# Altium schematic sheet 0225_GPU_GPIO 1 OF 2.SchDoc
size 848 x 558 mm
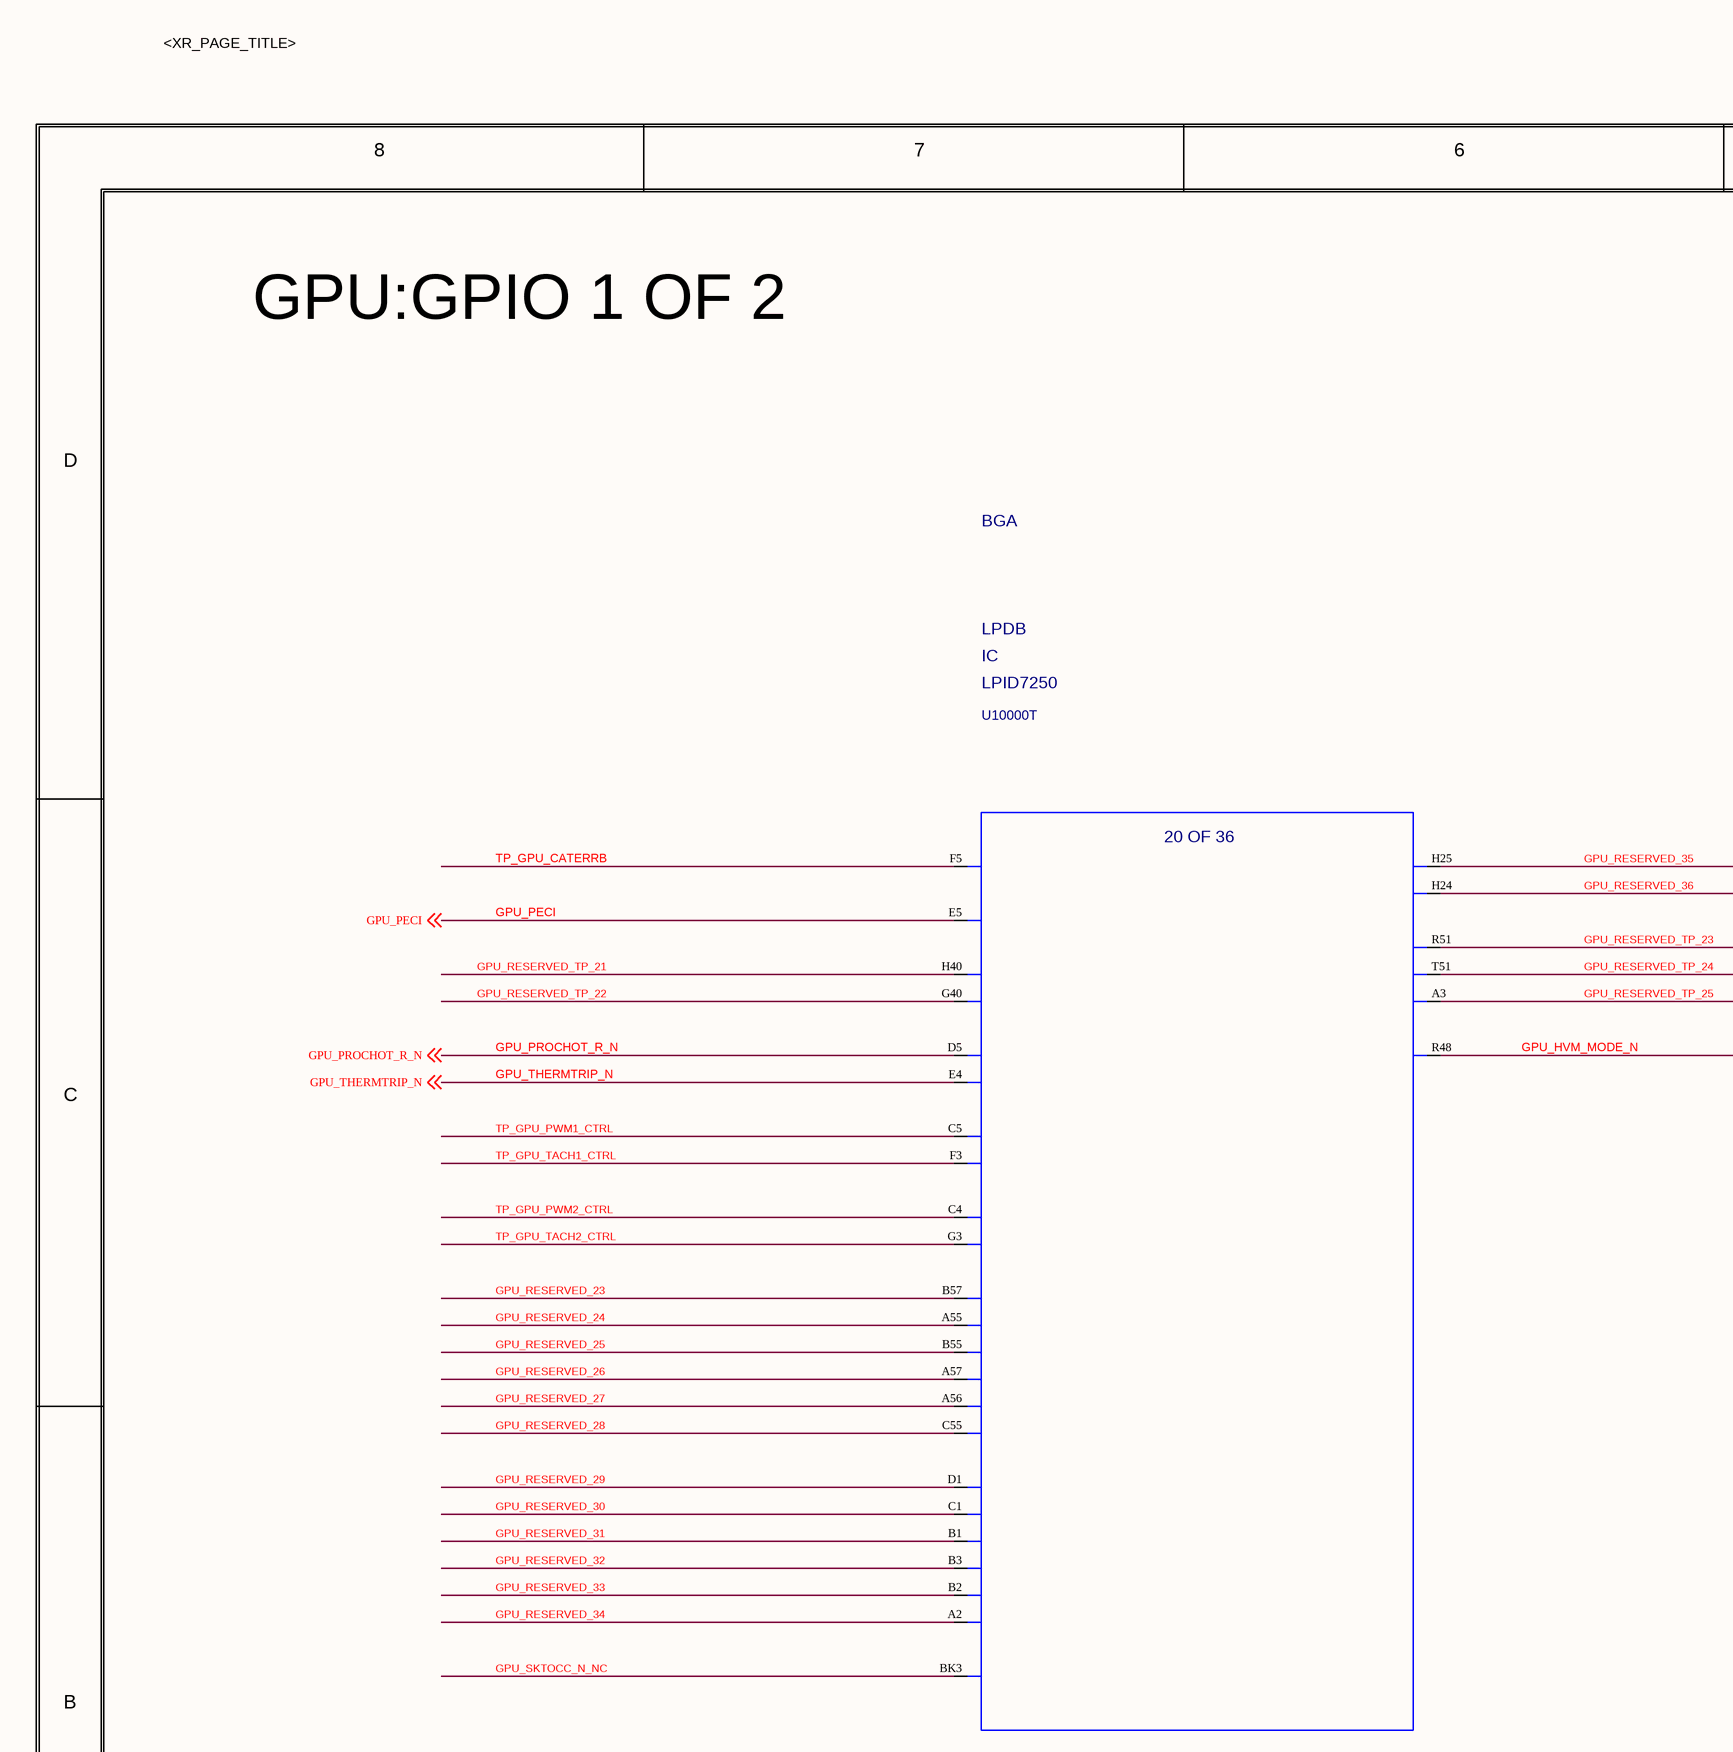
[diagram p0: 0225_GPU_GPIO 1 OF 2.SchDoc, top left]
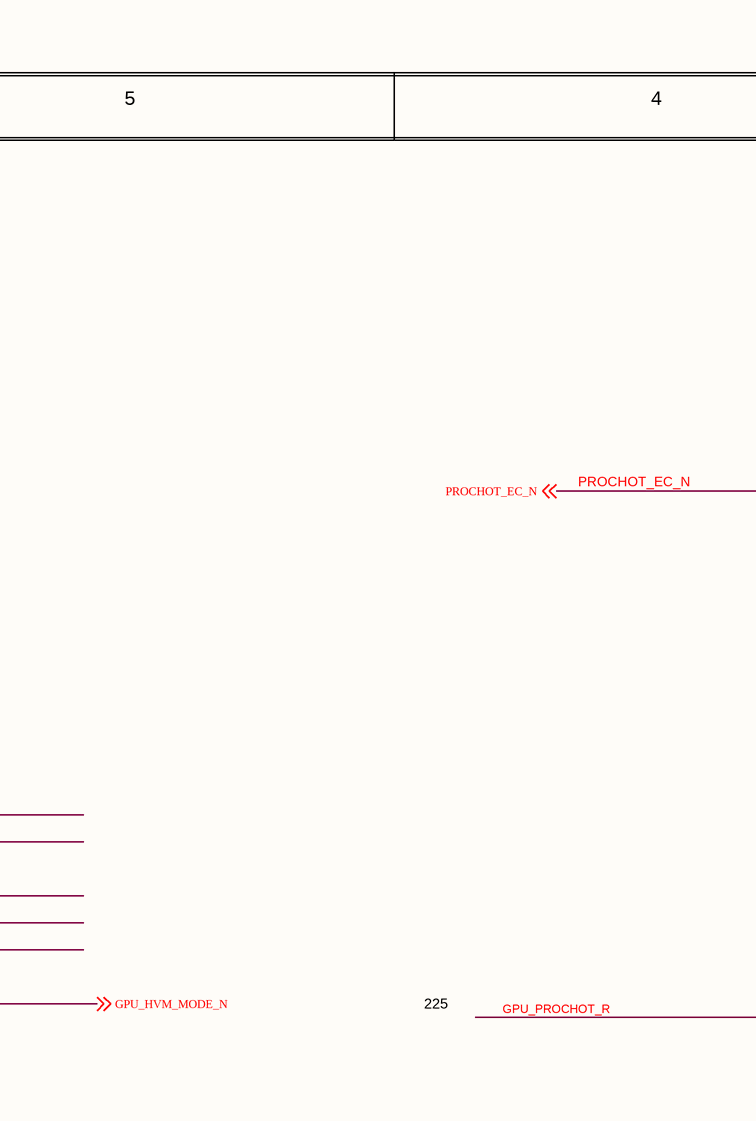
[diagram p1: 0225_GPU_GPIO 1 OF 2.SchDoc, top middle]
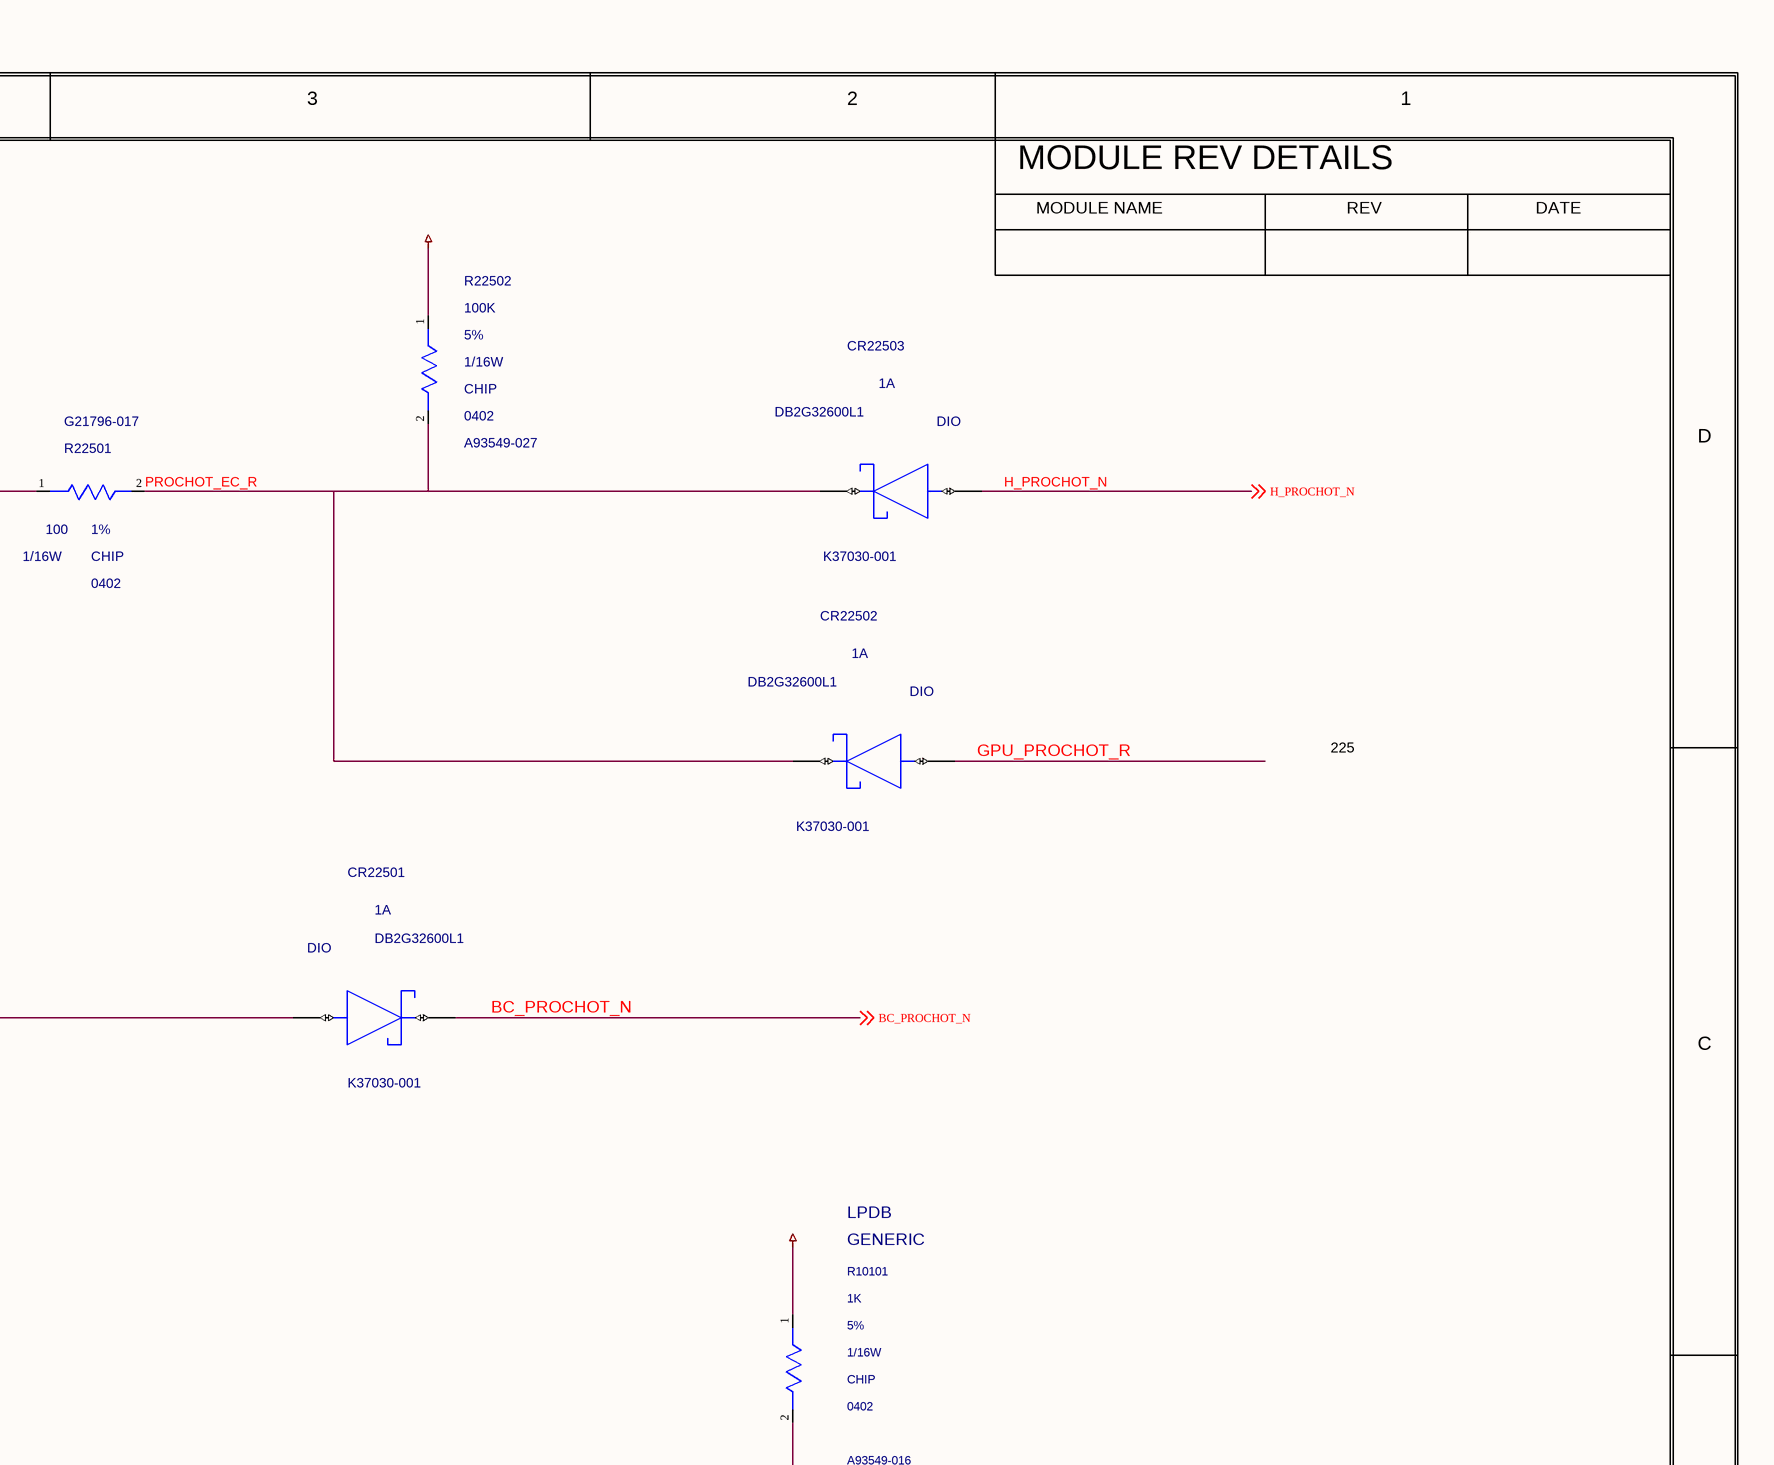
[diagram p2: 0225_GPU_GPIO 1 OF 2.SchDoc, top right]
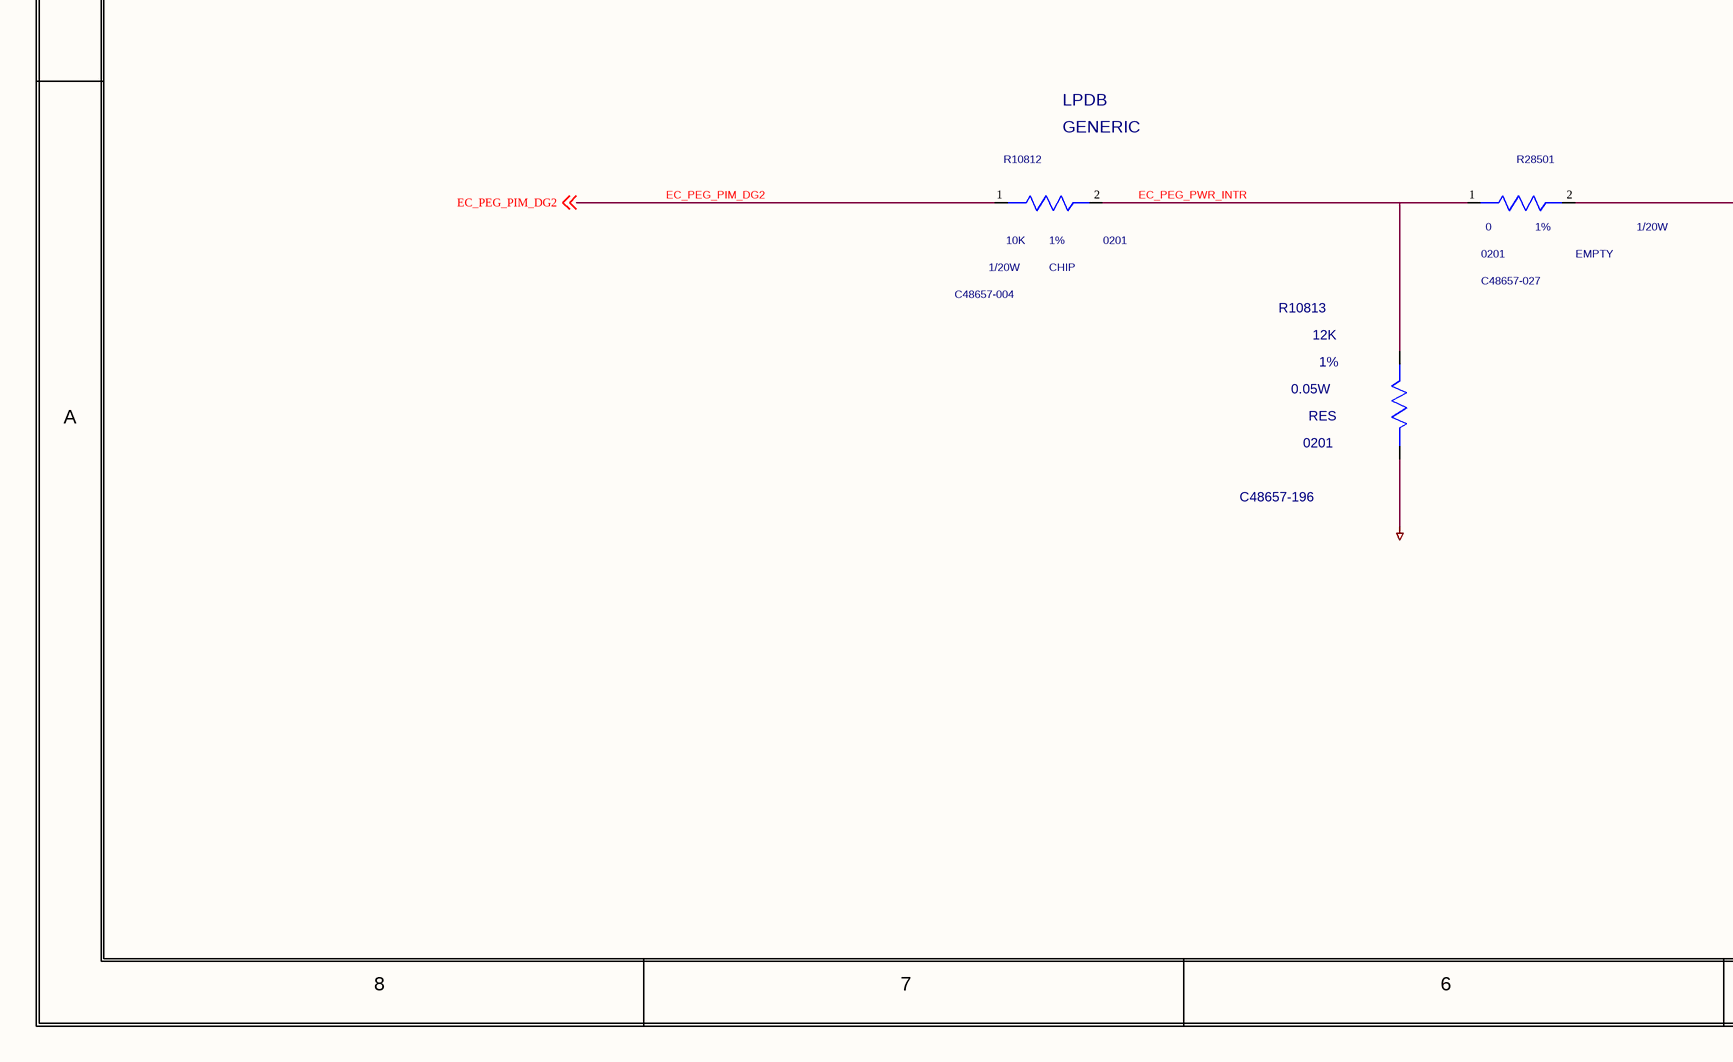
[diagram p3: 0225_GPU_GPIO 1 OF 2.SchDoc, bottom left]
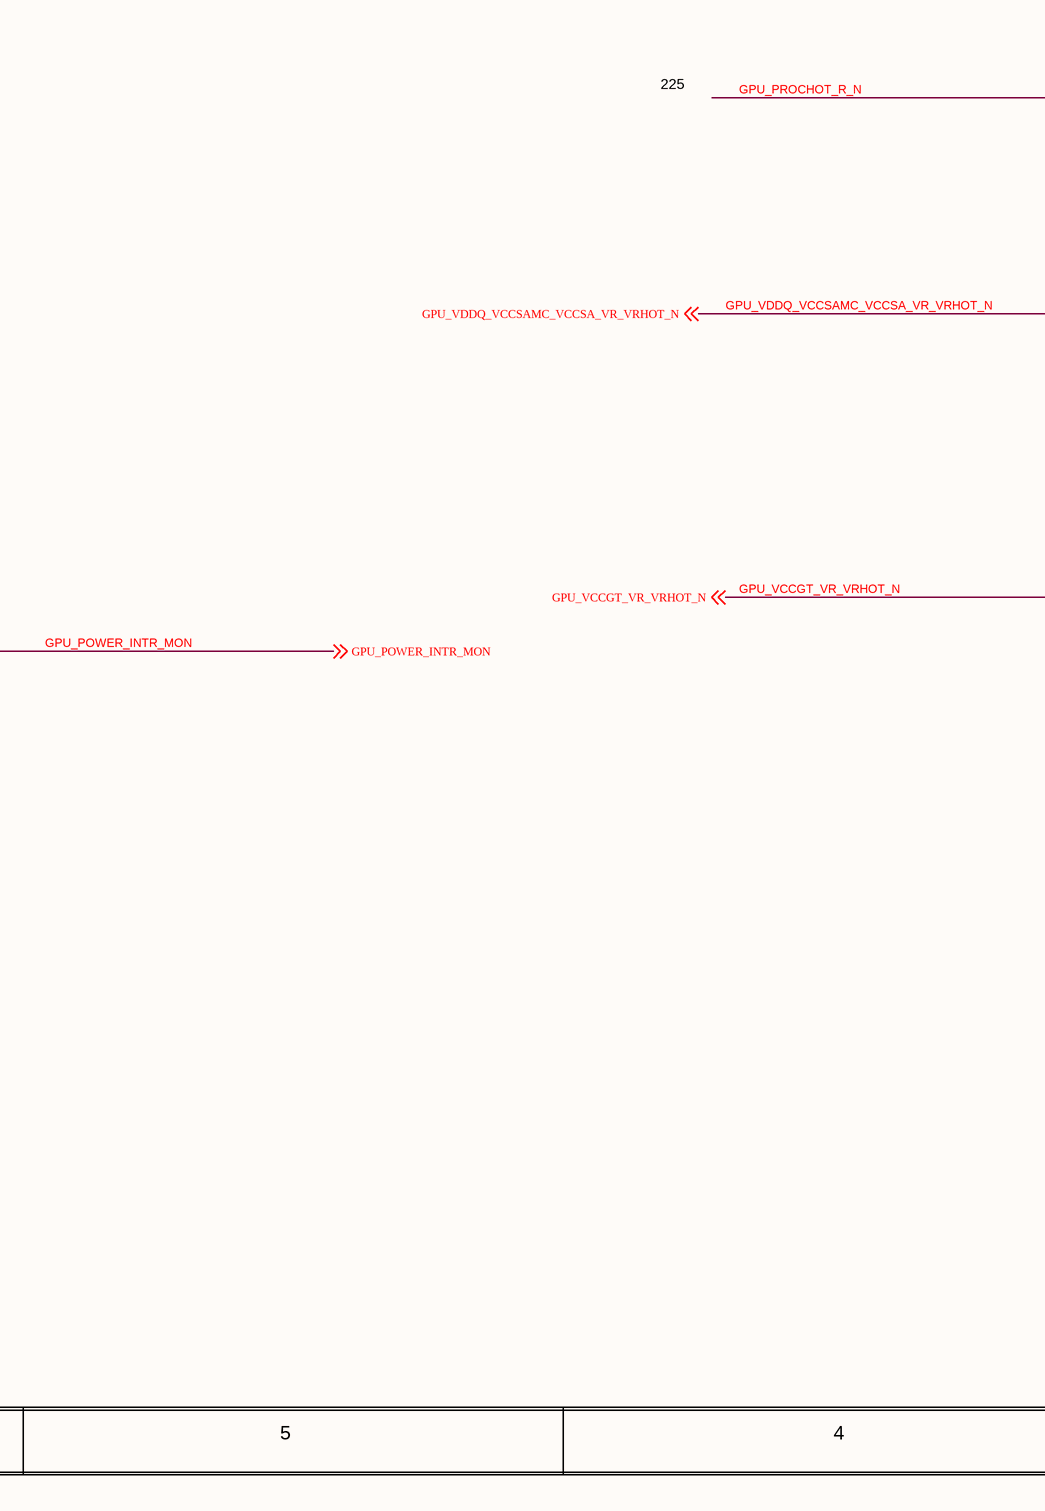
[diagram p4: 0225_GPU_GPIO 1 OF 2.SchDoc, bottom middle]
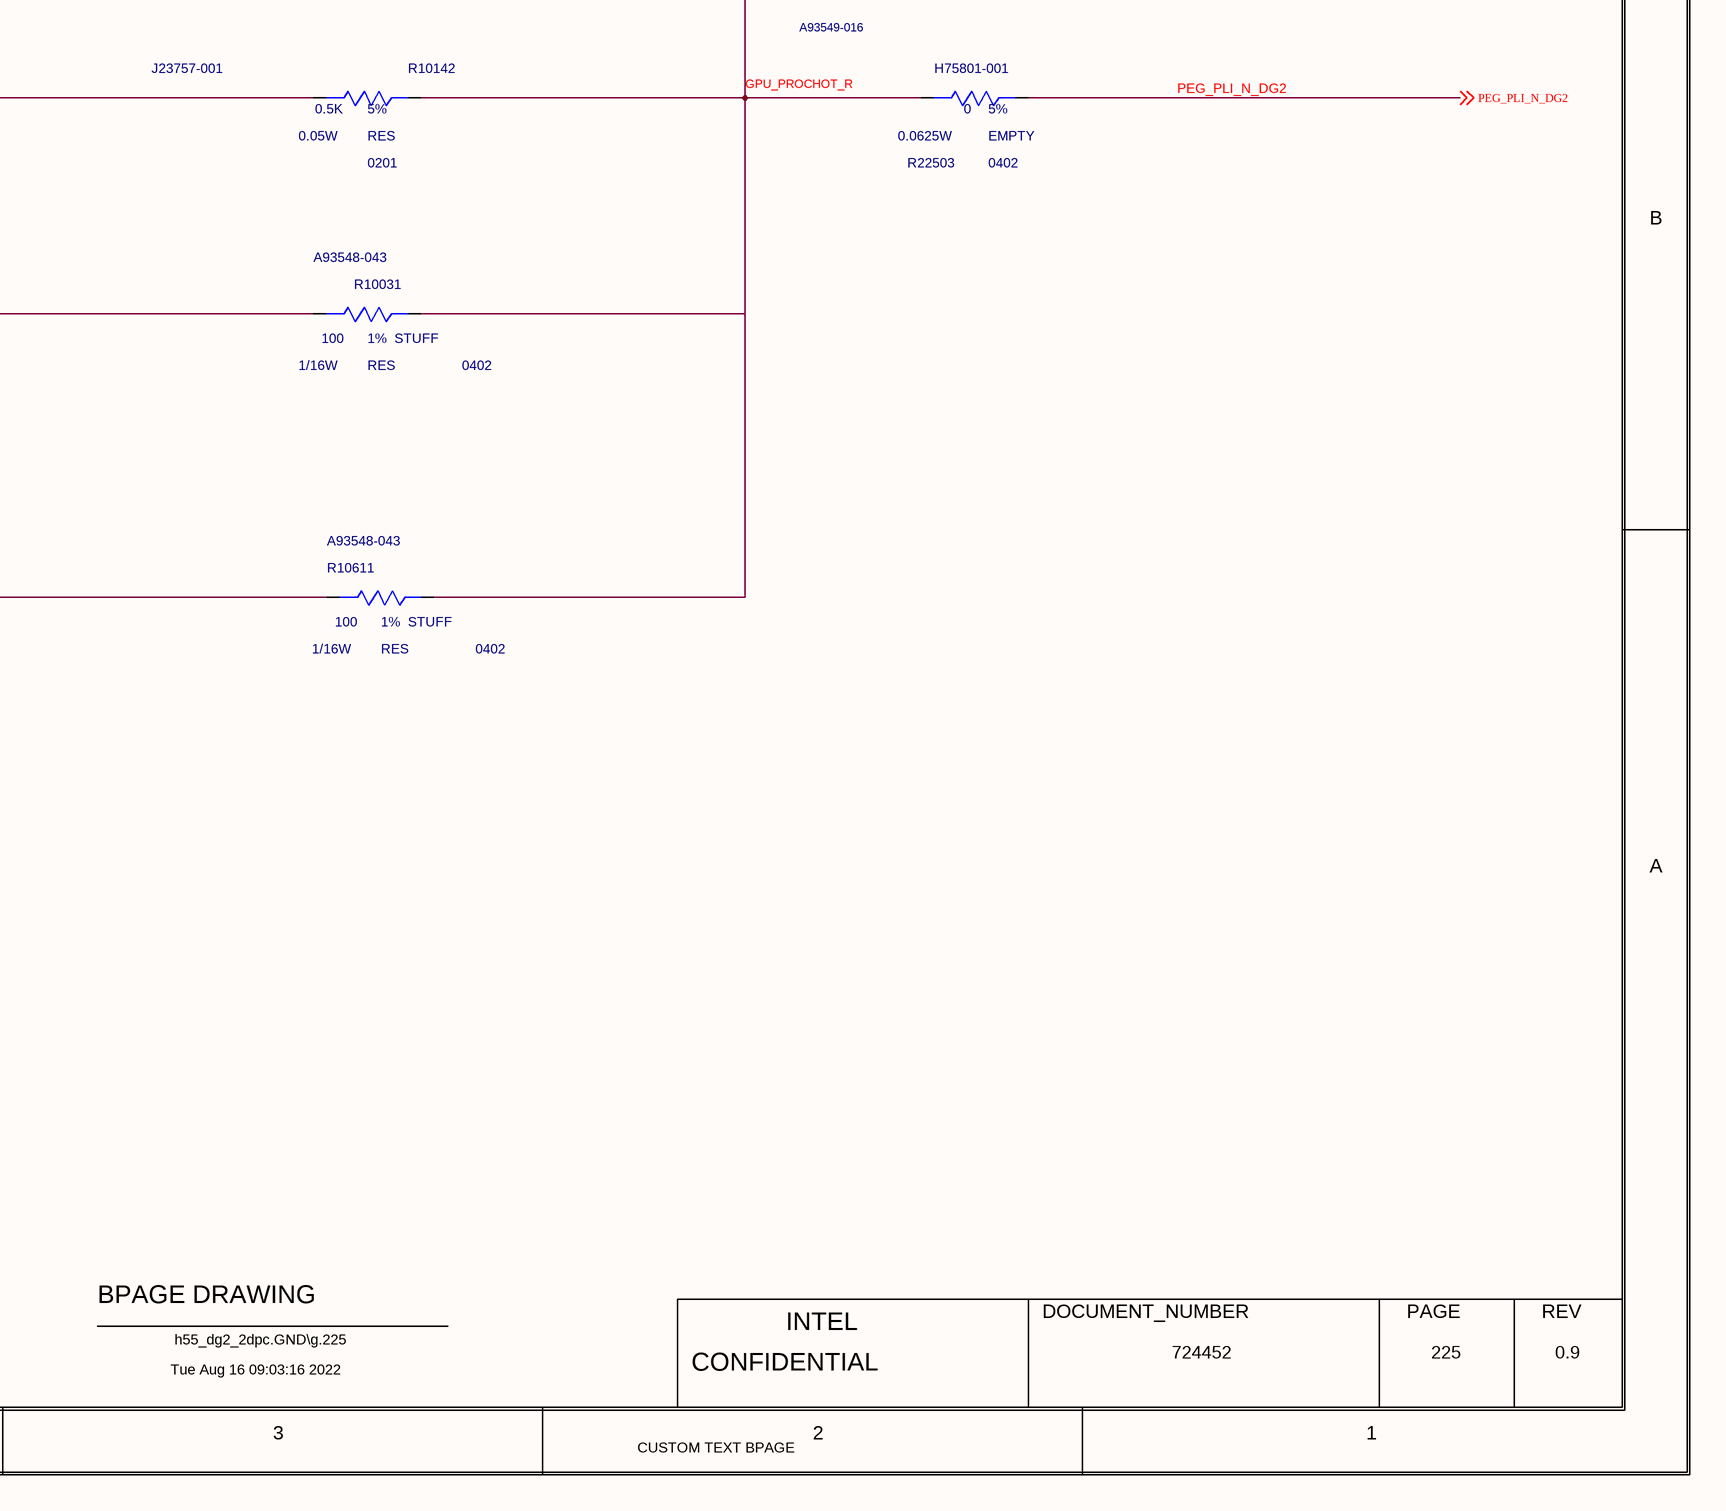
[diagram p5: 0225_GPU_GPIO 1 OF 2.SchDoc, bottom right]

## Parts
CR22501  DB2G32600L1  CURRENT: 1A  MATERIAL: DIO  PART_NUMBER: K37030-001  [TK0_SCR0402_1050X650_MA]
CR22502  DB2G32600L1  CURRENT: 1A  MATERIAL: DIO  PART_NUMBER: K37030-001  [TK0_SCR0402_1050X650_MA]
CR22503  DB2G32600L1  CURRENT: 1A  MATERIAL: DIO  PART_NUMBER: K37030-001  [TK0_SCR0402_1050X650_MA]
R10031  100  BOM_USE: STUFF  MATERIAL: RES  PACK_TYPE: 0402  PART_NUMBER: A93548-043  TOLERANCE: 1%  WATTAGE: 1/16W  [TK2_SM0402_1050X550_MA]
R10101  1K  MATERIAL: CHIP  PACK_TYPE: 0402  PART_NUMBER: A93549-016  TOLERANCE: 5%  WATTAGE: 1/16W  IP: GENERIC  FP_TECH: LPDB  [SMR0402IA]
R10142  0.5K  MATERIAL: RES  PACK_TYPE: 0201  PART_NUMBER: J23757-001  TOLERANCE: 5%  WATTAGE: 0.05W  [TK0_SM0201_630X330_ME]
R10611  100  BOM_USE: STUFF  MATERIAL: RES  PACK_TYPE: 0402  PART_NUMBER: A93548-043  TOLERANCE: 1%  WATTAGE: 1/16W  [TK2_SM0402_1050X550_MA]
R10812  10K  MATERIAL: CHIP  PACK_TYPE: 0201  PART_NUMBER: C48657-004  TOLERANCE: 1%  WATTAGE: 1/20W  IP: GENERIC  FP_TECH: LPDB  [SMR0201IA]
R10813  12K  MATERIAL: RES  PACK_TYPE: 0201  PART_NUMBER: C48657-196  TOLERANCE: 1%  WATTAGE: 0.05W  [CTK0_SM0201_630X330_MA]
R22501  100  MATERIAL: CHIP  PACK_TYPE: 0402  PART_NUMBER: G21796-017  TOLERANCE: 1%  WATTAGE: 1/16W  [SMR0402IA]
R22502  100K  MATERIAL: CHIP  PACK_TYPE: 0402  PART_NUMBER: A93549-027  TOLERANCE: 5%  WATTAGE: 1/16W  [SMR0402IA]
R22503  0  MATERIAL: EMPTY  PACK_TYPE: 0402  PART_NUMBER: H75801-001  TOLERANCE: 5%  WATTAGE: 0.0625W  [CTK2_SM0402_1100X550_MA]
R28501  0  MATERIAL: EMPTY  PACK_TYPE: 0201  PART_NUMBER: C48657-027  TOLERANCE: 1%  WATTAGE: 1/20W  [SMR0201IA]
U10000  PART_NUMBER: LPID7250  PACK_TYPE: BGA  MATERIAL: IC  FP_TECH: LPDB  [CLPDB_BGA2660_DG2_SVC_512_LP7250_MA]  (hidden comment: DG2_IP_NB_SKU1_SKU2_SKU3_EXT)  (part T of 36)

## Nets
+V1P8S_GPU: R10101.1(A)
+V3P3A: R22502.1(A)
GND: R10813.2(B)
BC_PROCHOT_N: CR22501.1(CATHODE) ; off-sheet BC_PROCHOT_N
EC_PEG_PIM_DG2: R10812.1(A) ; off-sheet EC_PEG_PIM_DG2
EC_PEG_PWR_INTR: R10812.2(B) R10813.1(A) R28501.1(A)
GPU_HVM_MODE_N: U10000.R48(HVM_MODE#) ; off-sheet GPU_HVM_MODE_N
GPU_PECI: U10000.E5(PECI) ; off-sheet GPU_PECI
GPU_POWER_INTR_MON: R28501.2(B) ; off-sheet GPU_POWER_INTR_MON
GPU_PROCHOT_R: CR22501.2(ANODE) CR22502.2(ANODE) R10031.2(B) R10101.2(B) R10142.2(B) R10611.2(B) R22503.1(A)
GPU_PROCHOT_R_N: R10142.1(A) U10000.D5(PROCHOT#) ; off-sheet GPU_PROCHOT_R_N
GPU_RESERVED_23: U10000.B57(RSVD_23)
GPU_RESERVED_24: U10000.A55(RSVD_24)
GPU_RESERVED_25: U10000.B55(RSVD_25)
GPU_RESERVED_26: U10000.A57(RSVD_26)
GPU_RESERVED_27: U10000.A56(RSVD_27)
GPU_RESERVED_28: U10000.C55(RSVD_28)
GPU_RESERVED_29: U10000.D1(RSVD_29)
GPU_RESERVED_30: U10000.C1(RSVD_30)
GPU_RESERVED_31: U10000.B1(RSVD_31)
GPU_RESERVED_32: U10000.B3(RSVD_32)
GPU_RESERVED_33: U10000.B2(RSVD_33)
GPU_RESERVED_34: U10000.A2(RSVD_34)
GPU_RESERVED_35: U10000.H25(RSVD_35)
GPU_RESERVED_36: U10000.H24(RSVD_36)
GPU_RESERVED_TP_21: U10000.H40(RSVD_TP_21)
GPU_RESERVED_TP_22: U10000.G40(RSVD_TP_22)
GPU_RESERVED_TP_23: U10000.R51(RSVD_TP_23)
GPU_RESERVED_TP_24: U10000.T51(RSVD_TP_24)
GPU_RESERVED_TP_25: U10000.A3(RSVD_TP_25)
GPU_SKTOCC_N_NC: U10000.BK3(SKTOCC#)
GPU_THERMTRIP_N: U10000.E4(THRMTRIP#) ; off-sheet GPU_THERMTRIP_N
GPU_VCCGT_VR_VRHOT_N: R10611.1(A) ; off-sheet GPU_VCCGT_VR_VRHOT_N
GPU_VDDQ_VCCSAMC_VCCSA_VR_VRHOT_N: R10031.1(A) ; off-sheet GPU_VDDQ_VCCSAMC_VCCSA_VR_VRHOT_N
H_PROCHOT_N: CR22503.2(ANODE) ; off-sheet H_PROCHOT_N
PEG_PLI_N_DG2: R22503.2(B) ; off-sheet PEG_PLI_N_DG2
PROCHOT_EC_N: R22501.1(A) ; off-sheet PROCHOT_EC_N
PROCHOT_EC_R: CR22502.1(CATHODE) CR22503.1(CATHODE) R22501.2(B) R22502.2(B)
TP_GPU_CATERRB: U10000.F5(CATERR#)
TP_GPU_PWM1_CTRL: U10000.C5(PWM1_CTRL)
TP_GPU_PWM2_CTRL: U10000.C4(PWM2_CTRL)
TP_GPU_TACH1_CTRL: U10000.F3(TACH1_CTRL)
TP_GPU_TACH2_CTRL: U10000.G3(TACH2_CTRL)

## Notes on the sheet
- <XR_PAGE_TITLE>
- 8
- 7
- 6
- 5
- 4
- 3
- 2
- 1
- MODULE REV DETAILS
- MODULE NAME
- REV
- DATE
- GPU:GPIO 1 OF 2
- D
- 225
- C
- B
- A
- BPAGE DRAWING
- INTEL
- DOCUMENT_NUMBER
- PAGE
- Tue Aug 16 09:03:16 2022
- h55_dg2_2dpc.GND\g.225
- CONFIDENTIAL
- 724452
- 0.9
- CUSTOM TEXT BPAGE
- (in symbol DG2_IP_NB_SKU1_SKU2_SKU3_EXT, part T) 20 OF 36

## Library data of the parts
CR22501 = DIODE_SCHOTTKY_2: CDS_PHYS_PART_NAME: DIODE_SCHOTTKY_2_SM-K37030-001,DIO,DB2G32600L1,1A,TK0,GENERIC; BOM_USE: STUFF; CDS_LMAN_SYM_OUTLINE: -50,100,50,-100; FP_TECH: TK0; IP: GENERIC; PACK_TYPE: SM; ROOM: NONE; OriginalSymbolOrigin: (-75,50); XY: (5375,4775); VER: 1; ROT: 0; PHYS_PAGE: 225; LOCATION: CR22501; DRAWING: @RVP1_ADL_SB_ADP_S_DDR5_SODIMM_2DPC_LIB.H55_DG2_2DPC(SCH_1):PAGE396; CDS_LIB: local; VARIANT: ?; PCB Footprint: TK0_SCR0402_1050X650_MA; CHIPS_PART_NAME: DIODE_SCHOTTKY_2; CDS_PART_NAME: DIODE_SCHOTTKY_2_SM-K37030-001,DIO,DB2G32600L1,1A,TK0,GENERIC; CDS_LOCATION: CR22501
CR22502 = DIODE_SCHOTTKY_2: CDS_PHYS_PART_NAME: DIODE_SCHOTTKY_2_SM-K37030-001,DIO,DB2G32600L1,1A,TK0,GENERIC; BOM_USE: STUFF; CDS_LMAN_SYM_OUTLINE: -50,100,50,-100; FP_TECH: TK0; IP: GENERIC; PACK_TYPE: SM; ROOM: NONE; OriginalSymbolOrigin: (-75,50); XY: (6300,5250); VER: 1; ROT: 2; PHYS_PAGE: 225; LOCATION: CR22502; DRAWING: @RVP1_ADL_SB_ADP_S_DDR5_SODIMM_2DPC_LIB.H55_DG2_2DPC(SCH_1):PAGE396; CDS_LIB: local; VARIANT: ?; PCB Footprint: TK0_SCR0402_1050X650_MA; CHIPS_PART_NAME: DIODE_SCHOTTKY_2; CDS_PART_NAME: DIODE_SCHOTTKY_2_SM-K37030-001,DIO,DB2G32600L1,1A,TK0,GENERIC; CDS_LOCATION: CR22502
CR22503 = DIODE_SCHOTTKY_2: CDS_PHYS_PART_NAME: DIODE_SCHOTTKY_2_SM-K37030-001,DIO,DB2G32600L1,1A,TK0,GENERIC; BOM_USE: STUFF; CDS_LMAN_SYM_OUTLINE: -50,100,50,-100; FP_TECH: TK0; IP: GENERIC; PACK_TYPE: SM; ROOM: NONE; OriginalSymbolOrigin: (-75,50); XY: (6350,5750); VER: 1; ROT: 2; PHYS_PAGE: 225; LOCATION: CR22503; DRAWING: @RVP1_ADL_SB_ADP_S_DDR5_SODIMM_2DPC_LIB.H55_DG2_2DPC(SCH_1):PAGE396; CDS_LIB: local; VARIANT: ?; PCB Footprint: TK0_SCR0402_1050X650_MA; CHIPS_PART_NAME: DIODE_SCHOTTKY_2; CDS_PART_NAME: DIODE_SCHOTTKY_2_SM-K37030-001,DIO,DB2G32600L1,1A,TK0,GENERIC; CDS_LOCATION: CR22503
R10031 = RES_2#1: CHIPS_PART_NAME: RES_2; CDS_PHYS_PART_NAME: RES_2_0402-A93548-043,RES,100,1%,1/16W,TK2,GENERIC; CDS_LMAN_SYM_OUTLINE: -50,50,50,-50; FP_TECH: TK2; IP: GENERIC; ROOM: NONE; OriginalSymbolOrigin: (-75,25); XY: (5450,3425); VER: 1; ROT: 0; PHYS_PAGE: 225; LOCATION: R10031; DRAWING: @RVP1_ADL_SB_ADP_S_DDR5_SODIMM_2DPC_LIB.H55_DG2_2DPC(SCH_1):PAGE396; CDS_LIB: discrete_2; VARIANT: ?; PCB Footprint: TK2_SM0402_1050X550_MA; CDS_PART_NAME: RES_2_0402-A93548-043,RES,100,1%,1/16W,TK2,GENERIC; CDS_LOCATION: R10031
R10101 = RES: CDS_PHYS_PART_NAME: RES_0402-A93549-016,CHIP,1K,5%,1/16W,LPDB,GENERIC; OriginalSymbolOrigin: (-25,75); XY: (6150,4125); VER: 2; ROT: 0; PHYS_PAGE: 225; LOCATION: R10101; DRAWING: @RVP1_ADL_SB_ADP_S_DDR5_SODIMM_2DPC_LIB.H55_DG2_2DPC(SCH_1):PAGE396; CDS_LIB: discrete; PCB Footprint: SMR0402IA; CHIPS_PART_NAME: RES; CDS_PART_NAME: RES_0402-A93549-016,CHIP,1K,5%,1/16W,LPDB,GENERIC; CDS_LOCATION: R10101
R10142 = RES_2#1: CHIPS_PART_NAME: RES_2; CDS_PHYS_PART_NAME: RES_2_0201-J23757-001,RES,0.5K,5%,0.05W,TK0,GENERIC; BOM_USE: STUFF; CDS_LMAN_SYM_OUTLINE: -50,50,50,-50; FP_TECH: TK0; IP: GENERIC; ROOM: NONE; OriginalSymbolOrigin: (-75,25); XY: (5450,3825); VER: 1; ROT: 0; PHYS_PAGE: 225; LOCATION: R10142; DRAWING: @RVP1_ADL_SB_ADP_S_DDR5_SODIMM_2DPC_LIB.H55_DG2_2DPC(SCH_1):PAGE396; CDS_LIB: discrete_2; VARIANT: ?; PCB Footprint: TK0_SM0201_630X330_ME; CDS_PART_NAME: RES_2_0201-J23757-001,RES,0.5K,5%,0.05W,TK0,GENERIC; CDS_LOCATION: R10142
R10611 = RES_2#1: CHIPS_PART_NAME: RES_2; CDS_PHYS_PART_NAME: RES_2_0402-A93548-043,RES,100,1%,1/16W,TK2,GENERIC; CDS_LMAN_SYM_OUTLINE: -50,50,50,-50; FP_TECH: TK2; IP: GENERIC; ROOM: NONE; OriginalSymbolOrigin: (-75,25); XY: (5475,2900); VER: 1; ROT: 0; PHYS_PAGE: 225; LOCATION: R10611; DRAWING: @RVP1_ADL_SB_ADP_S_DDR5_SODIMM_2DPC_LIB.H55_DG2_2DPC(SCH_1):PAGE396; CDS_LIB: discrete_2; VARIANT: ?; PCB Footprint: TK2_SM0402_1050X550_MA; CDS_PART_NAME: RES_2_0402-A93548-043,RES,100,1%,1/16W,TK2,GENERIC; CDS_LOCATION: R10611
R10812 = RES#1: CHIPS_PART_NAME: RES; CDS_PHYS_PART_NAME: RES_0201-C48657-004,CHIP,10K,1%,1/20W,LPDB,GENERIC; OriginalSymbolOrigin: (-75,25); XY: (1525,2800); VER: 1; ROT: 0; PHYS_PAGE: 225; LOCATION: R10812; DRAWING: @RVP1_ADL_SB_ADP_S_DDR5_SODIMM_2DPC_LIB.H55_DG2_2DPC(SCH_1):PAGE396; CDS_LIB: discrete; PCB Footprint: SMR0201IA; CDS_PART_NAME: RES_0201-C48657-004,CHIP,10K,1%,1/20W,LPDB,GENERIC; CDS_LOCATION: R10812
R10813 = C_RES: CDS_PHYS_PART_NAME: C_RES_0201-C48657-196,RES,12K,1%,0.05W,TK0,GENERIC; CDS_LMAN_SYM_OUTLINE: -50,50,50,-50; FP_TECH: TK0; IP: GENERIC; ROOM: NONE; OriginalSymbolOrigin: (-25,75); XY: (2175,2425); VER: 2; PHYS_PAGE: 225; LOCATION: R10813; DRAWING: @RVP1_ADL_SB_ADP_S_DDR5_SODIMM_2DPC_LIB.H55_DG2_2DPC(SCH_1):PAGE396; CDS_LIB: c_discrete; VARIANT: ?; PCB Footprint: CTK0_SM0201_630X330_MA; ROT: 2; CHIPS_PART_NAME: C_RES; CDS_PART_NAME: C_RES_0201-C48657-196,RES,12K,1%,0.05W,TK0,GENERIC; CDS_LOCATION: R10813
R22501 = RES#1: CHIPS_PART_NAME: RES; CDS_PHYS_PART_NAME: RES_0402-G21796-017,CHIP,100,1%,1/16W,LPDB,GENERIC; OriginalSymbolOrigin: (-75,25); XY: (4850,5750); VER: 1; ROT: 0; PHYS_PAGE: 225; LOCATION: R22501; IP: GENERIC; FP_TECH: LPDB; DRAWING: @RVP1_ADL_SB_ADP_S_DDR5_SODIMM_2DPC_LIB.H55_DG2_2DPC(SCH_1):PAGE396; CDS_LIB: discrete; PCB Footprint: SMR0402IA; CDS_PART_NAME: RES_0402-G21796-017,CHIP,100,1%,1/16W,LPDB,GENERIC; CDS_LOCATION: R22501
R22502 = RES: CDS_PHYS_PART_NAME: RES_0402-A93549-027,CHIP,100K,5%,1/16W,LPDB,GENERIC; OriginalSymbolOrigin: (-25,75); XY: (5475,5975); VER: 2; ROT: 0; PHYS_PAGE: 225; LOCATION: R22502; IP: GENERIC; FP_TECH: LPDB; DRAWING: @RVP1_ADL_SB_ADP_S_DDR5_SODIMM_2DPC_LIB.H55_DG2_2DPC(SCH_1):PAGE396; CDS_LIB: discrete; PCB Footprint: SMR0402IA; CHIPS_PART_NAME: RES; CDS_PART_NAME: RES_0402-A93549-027,CHIP,100K,5%,1/16W,LPDB,GENERIC; CDS_LOCATION: R22502
R22503 = C_RES#1: CHIPS_PART_NAME: C_RES; CDS_PHYS_PART_NAME: C_RES_0402-H75801-001,EMPTY,0,5%,0.0625W,TK2,GENERIC; CDS_LMAN_SYM_OUTLINE: -50,50,50,-50; FP_TECH: TK2; IP: GENERIC; ROOM: NONE; OriginalSymbolOrigin: (-75,25); XY: (6575,3825); VER: 1; PHYS_PAGE: 225; LOCATION: R22503; DRAWING: @RVP1_ADL_SB_ADP_S_DDR5_SODIMM_2DPC_LIB.H55_DG2_2DPC(SCH_1):PAGE396; CDS_LIB: c_discrete; VARIANT: ?; PCB Footprint: CTK2_SM0402_1100X550_MA; ROT: 0; CDS_PART_NAME: C_RES_0402-H75801-001,EMPTY,0,5%,0.0625W,TK2,GENERIC; CDS_LOCATION: R22503
R28501 = RES#1: CHIPS_PART_NAME: RES; CDS_PHYS_PART_NAME: RES_0201-C48657-027,EMPTY,0,1%,1/20W,LPDB,GENERIC; OriginalSymbolOrigin: (-75,25); XY: (2400,2800); VER: 1; PHYS_PAGE: 225; LOCATION: R28501; FP_TECH: LPDB; DRAWING: @RVP1_ADL_SB_ADP_S_DDR5_SODIMM_2DPC_LIB.H55_DG2_2DPC(SCH_1):PAGE396; CDS_LIB: discrete; PCB Footprint: SMR0201IA; ROT: 0; CDS_PART_NAME: RES_0201-C48657-027,EMPTY,0,1%,1/20W,LPDB,GENERIC; CDS_LOCATION: R28501
U10000 = DG2_IP_NB_SKU1_SKU2_SKU3_EXT: MANUF: INTEL CORP; CDS_PHYS_PART_NAME: DG2_IP_NB_SKU1_SKU2_SKU3_EXT_BGA-LPID7250,IC,DG2_IP_NB_SKU1_SKUA; CDS_LMAN_SYM_OUTLINE: -300,850,300,-800; OriginalSymbolOrigin: (-325,850); CaptureCellPackProp: DG2_IP_NB_SKU1_SKU2_SKU3_EXTT; XY: (1800,4400); VER: 20; ROT: 0; PHYS_PAGE: 225; MFG_PN: NONE; LOCATION: U10000; DRAWING: @RVP1_ADL_SB_ADP_S_DDR5_SODIMM_2DPC_LIB.H55_DG2_2DPC(SCH_1):PAGE396; CDS_LIB: rvp1_adl_sb_adp_s_ddr5_sodimm_2dpc_lib; BMAP_REV: 1.0; PCB Footprint: CLPDB_BGA2660_DG2_SVC_512_LP7250_MA; SEC_TYPE: BGA; CHIPS_PART_NAME: DG2_IP_NB_SKU1_SKU2_SKU3_EXT; CDS_PART_NAME: DG2_IP_NB_SKU1_SKU2_SKU3_EXT_BGA-LPID7250,IC,DG2_IP_NB_SKU1_SKUA; CDS_LOCATION: U10000